# Altium schematic sheet PowerSupply.SchDoc
size A3; SheetNumber: 6; SheetTotal: 14
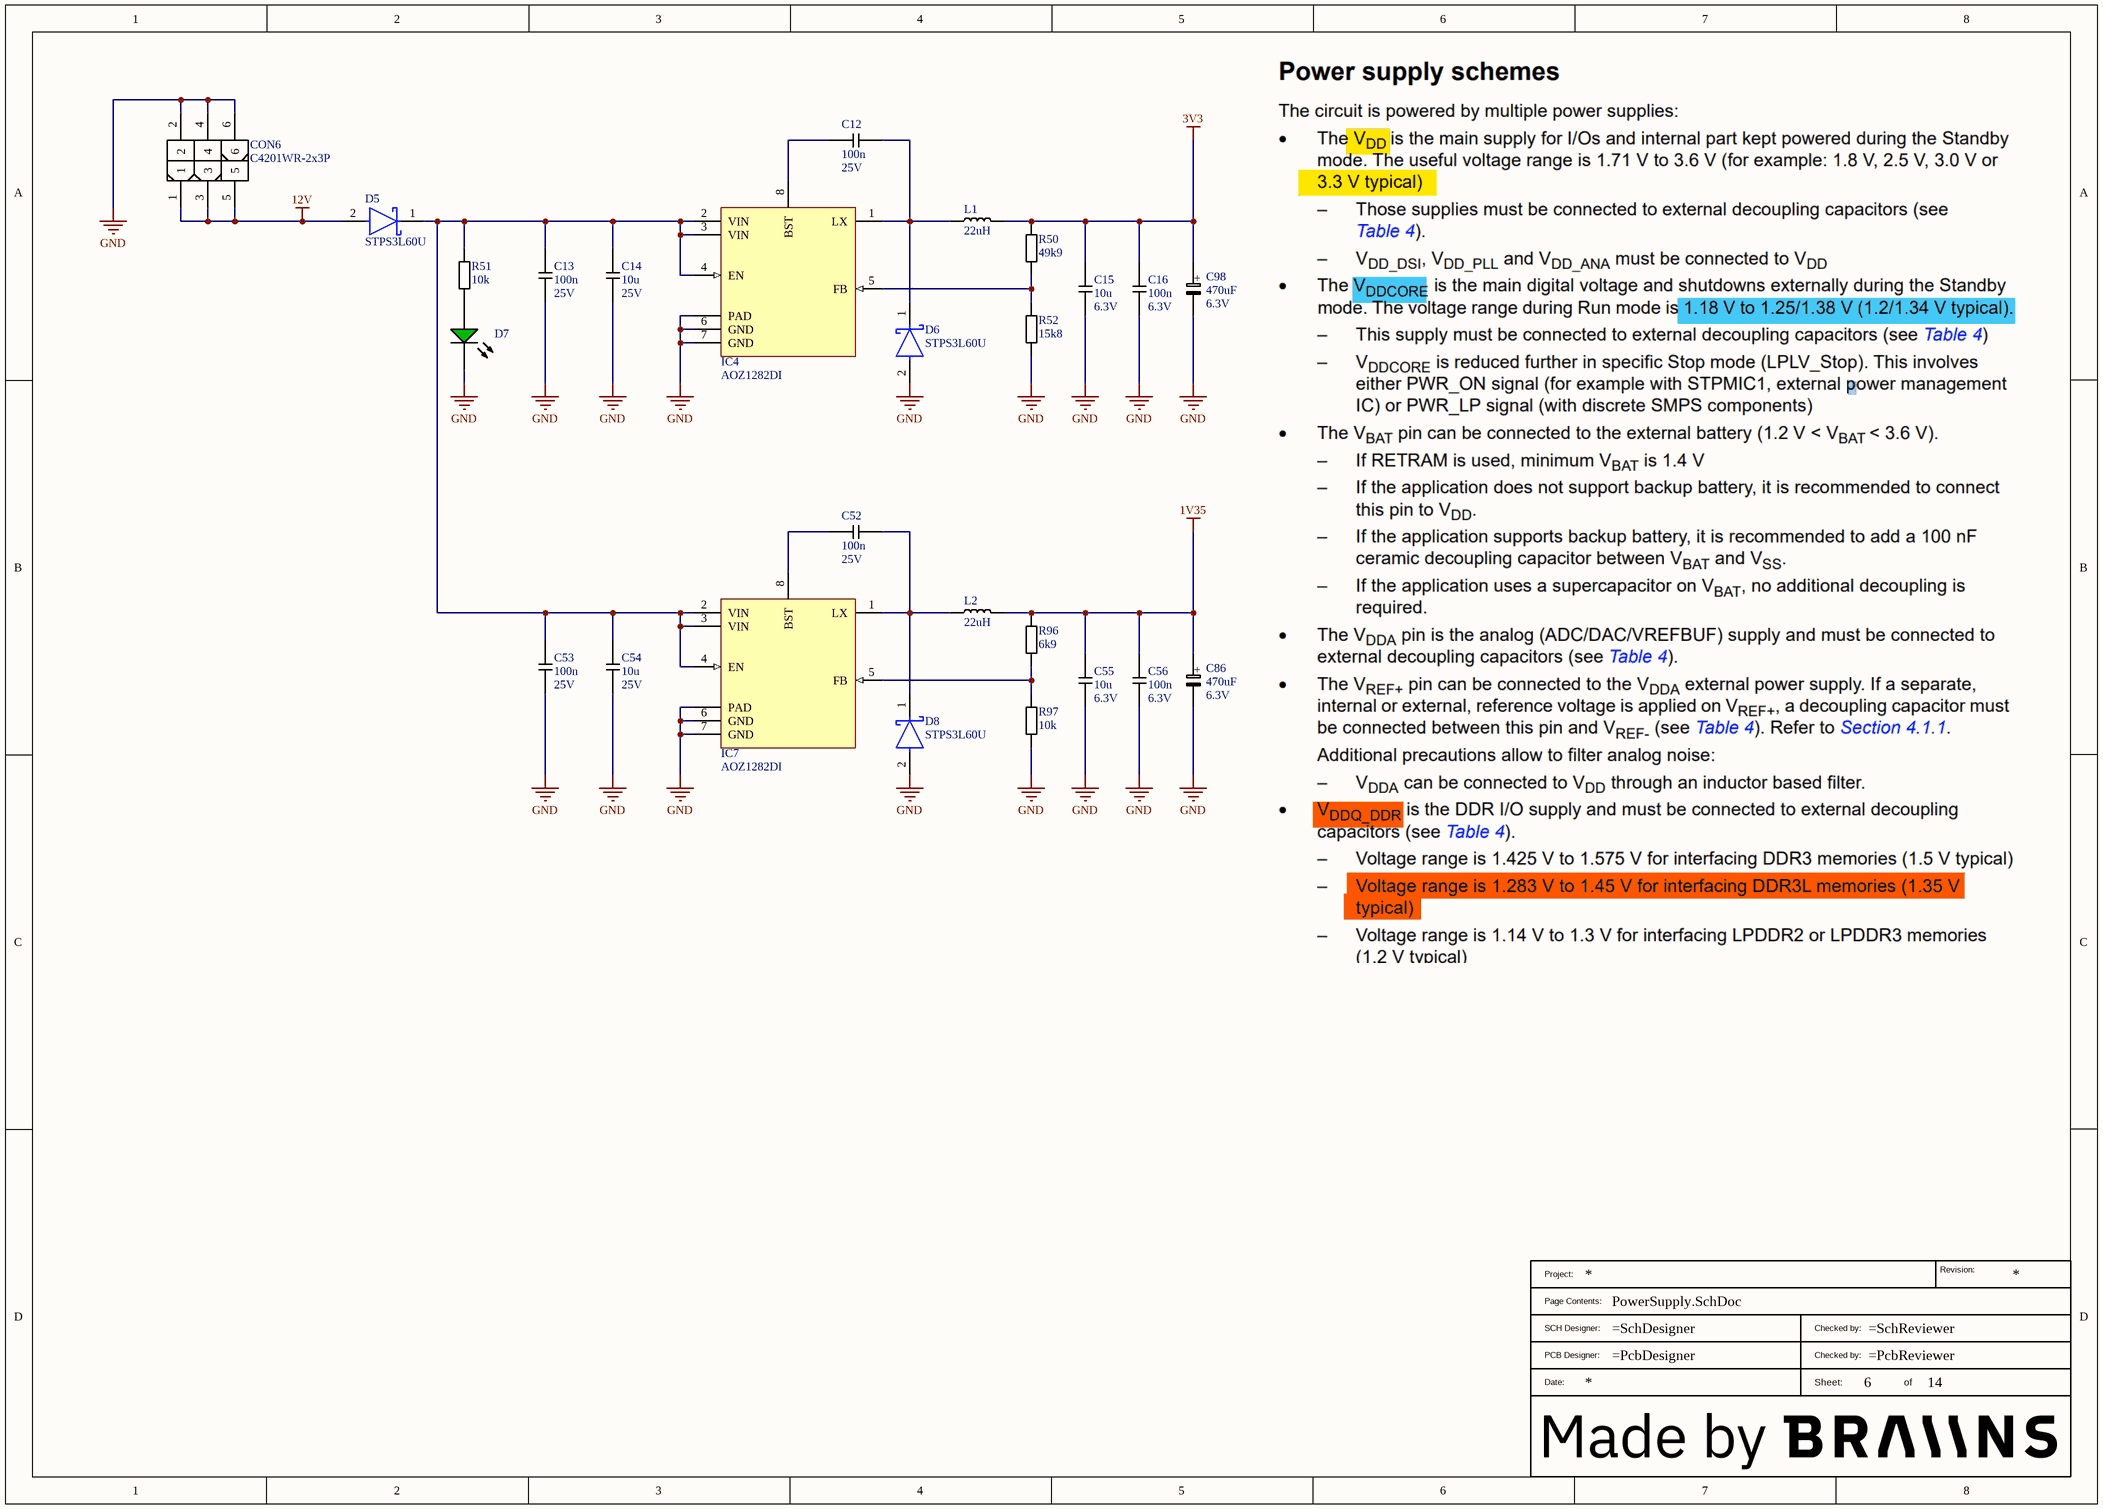
[diagram p0: PowerSupply.SchDoc]

## Parts
?  BraiinsTitleBlockWithLogo  (value not drawn)  (graphical)
C12  Voltage_Rating: 25V  [CAP0603]  (hidden comment: 100n)
C13  Voltage_Rating: 25V  [CAP0603]  (hidden comment: 100n)
C14  Voltage_Rating: 25V  [CAP1206]  (hidden comment: 10u)
C15  Voltage_Rating: 6.3V  [CAP0805]  (hidden comment: 10u)
C16  Voltage_Rating: 6.3V  [CAP0402]  (hidden comment: 100n)
C52  Voltage_Rating: 25V  [CAP0603]  (hidden comment: 100n)
C53  Voltage_Rating: 25V  [CAP0603]  (hidden comment: 100n)
C54  Voltage_Rating: 25V  [CAP1206]  (hidden comment: 10u)
C55  Voltage_Rating: 6.3V  [CAP0805]  (hidden comment: 10u)
C56  Voltage_Rating: 6.3V  [CAP0402]  (hidden comment: 100n)
C86  Voltage_Rating: 6.3V  [CAP_EEEFTJ471XAP]  (hidden comment: 470uF)
C98  Voltage_Rating: 6.3V  [CAP_EEEFTJ471XAP]  (hidden comment: 470uF)
CON6  C4201WR-2x3P  [MOLEX_39301061]
D5  STPS3L60U  [FP-SMB-MFG]
D6  STPS3L60U  [FP-SMB-MFG]
D7  FYLS-0603UGC  [AVAG-HSMX-C190_V]  (value not drawn)
D8  STPS3L60U  [FP-SMB-MFG]
IC4  AOZ1282DI  [DFN8_2X2]
IC7  AOZ1282DI  [DFN8_2X2]
L1  22uH  [VLS5045EX]
L2  22uH  [VLS5045EX]
R50  49k9  [RES0402]
R51  10k  [RES0603]
R52  15k8  [RES0402]
R96  6k9  [RES0402]
R97  10k  [RES0402]

## Nets
1V35: C55.1 C56.1 C86.1 L2.2 R96.1
3V3: C15.1 C16.1 C98.1 L1.2 R50.1
12V: CON6.1 CON6.3 CON6.5 D5.2(A)
GND: C13.2 C14.2 C15.2 C16.2 C53.2 C54.2 C55.2 C56.2 C86.2 C98.2 CON6.2 CON6.4 CON6.6 D6.2(A) D7.2(K) D8.2(A) IC4.6(GND) IC4.7(GND) IC4.PAD IC7.6(GND) IC7.7(GND) IC7.PAD R52.2 R97.2
NetC12_1: C12.1 IC4.8(BST)
NetC12_2: C12.2 D6.1(K) IC4.1(LX) L1.1
NetC13_1: C13.1 C14.1 C53.1 C54.1 D5.1(K) IC4.2(VIN) IC4.3(VIN) IC4.4(EN) IC7.2(VIN) IC7.3(VIN) IC7.4(EN) R51.1
NetC52_1: C52.1 IC7.8(BST)
NetC52_2: C52.2 D8.1(K) IC7.1(LX) L2.1
NetD7_1: D7.1(A) R51.2
NetIC4_5: IC4.5(FB) R50.2 R52.1
NetIC7_5: IC7.5(FB) R96.2 R97.1

## Notes on the sheet
- (in symbol 30239) +
- (in symbol BraiinsTitleBlockWithLogo) Revision:; Project:; Page Contents:; SCH Designer:; Checked by:; PCB Designer:; Date:; Sheet:; of

## Library data of the parts
C12 C13 C52 C53 = 30172: CAP CER 100n 10% 25V X7R 0603; Part_Type: Capacitor; Part_Status: New; ID: 30172; Updated By: janjuranek; Sorted_Value: 100; Value: 100n; Sub_Type: CER; Manufacturer Part Description: CAP CER 100n 10% 25V X7R 0603; Package_Case: 0603; RoHS: Yes; Dielectric: X7R; Tolerance: 10%; Created By: janjuranek; Created_Date: 2023-05-02 16:34:01; Updated_Date: 2023-05-02 16:34:23; ComponentLink1Description: Datasheet; ComponentLink2Description: Supplier Part Details
C14 C54 = 30171: CAP CER 10u 10% 25V X7R 1206; Part_Type: Capacitor; Part_Status: New; ID: 30171; Updated By: janjuranek; Sorted_Value: 10; Value: 10u; Sub_Type: CER; Manufacturer Part Description: CAP CER 10u 10% 25V X7R 1206; Package_Case: 1206; Dielectric: X7R; Tolerance: 10%; Created By: janjuranek; Created_Date: 2023-05-02 15:32:51; Updated_Date: 2023-05-02 15:37:12; ComponentLink1Description: Datasheet; ComponentLink2Description: Supplier Part Details
C15 C55 = 30174: CAP CER 10u 10% 6.3V X7R 0805; Part_Type: Capacitor; Part_Status: New; ID: 30174; Updated By: janjuranek; Sorted_Value: 10; Value: 10u; Sub_Type: CER; Manufacturer Part Description: CAP CER 10u 10% 6.3V X7R 0805; Package_Case: 0805; Dielectric: X7R; Tolerance: 10%; Created By: janjuranek; Created_Date: 2023-05-09 02:18:46; Updated_Date: 2023-05-09 02:19:22; ComponentLink1Description: Datasheet; ComponentLink2Description: Supplier Part Details; RoHS: Yes
C16 C56 = 30154: CAP CER 100n 10% 6.3V 0402; Part_Type: Capacitor; Part_Status: New; ID: 30154; Dielectric: X7R; Updated By: janjuranek; Sorted_Value: 100; Value: 100n; Sub_Type: CER; Manufacturer Part Description: CAP CER 100n 10% 6.3V 0402; Package_Case: 0402; RoHS: Yes; Tolerance: 10%; Created By: janjuranek; Created_Date: 2023-05-01 19:17:49; Updated_Date: 2023-05-01 19:19:14; ComponentLink1Description: Datasheet; ComponentLink2Description: Supplier Part Details
C86 C98 = 30239: CAP ELECT 470uF ±20% 6.3V Radial, Can - SMD; Part_Type: Capacitor; Manufacturer Part Number: EEE-FTJ471XAP; Manufacturer: Panasonic Electronic Components; Part_Status: New; ID: 30239; Sub_Type: POL; Updated By: janjuranek; Sorted_Value: 0,00047; Value: 470uF; Manufacturer Part Description: CAP ELECT 470uF ±20% 6.3V Radial, Can - SMD; Supplier 1: Digi-Key; Supplier Part Number 1: P15096TR-ND; Package_Case: Radial, Can - SMD; RoHS: Yes; Temperature Range: -55C to +105C; Tolerance: ±20%; Created By: janjuranek; Created_Date: 2023-10-13 11:39:12; Updated_Date: 2023-10-13 11:39:46; ComponentLink1Description: Datasheet; ComponentLink2Description: Supplier Part Details; ComponentLink2URL: https://www.digikey.com/products/en?keywords=EEE-FTJ471XAP
CON6 = 30196: CB Power Supply Connector; Manufacturer: CJT; Part_Status: New; ID: 30196; Updated By: janjuranek; Value: C4201WR-2x3P; Part_Type: Connector; Manufacturer Part Number: C4201WR-2x3P; Manufacturer Part Description: CB Power Supply Connector; Package_Case: THT; RoHS: Yes; Created By: janjuranek; Created_Date: 2023-06-06 15:12:03; Updated_Date: 2023-06-06 15:13:00; ComponentLink1Description: Datasheet; ComponentLink2Description: Supplier Part Details
D5 D6 D8 = CMP-12187-000023-1: DIODE SCHOTTKY 60V 3A SMB; Manufacturer: STMicroelectronics; Standoff Height: 0.05mm; Peak Reverse Current: 150uA; Max Junction Temp: +150°C; Max Surge Forward Current: 100A; Octopart: https://octopart.com/stps3l60u-stmicroelectronics-334329; Category: Diode; Height: 2.65mm; RoHS: TRUE; Mouser Description: Schottky diode Configuration: Single Housing type: DO-214AA=SMB Peak conducting-state current: 100 A; Forward Current: 3A; Manufacturer Part Number: STPS3L60U; Temperature: to +150°C; ComponentLink2URL: https://www.st.com/resource/en/datasheet/stps3l60.pdf; Max Repetitive Reverse Voltage: 60V; Device Class L1: Discrete Semiconductors; Automotive: No; Device Class L3: Schottky Diodes; Digikey Description: DIODE SCHOTTKY 60V 3A SMB; Lead Free: Yes; Temperature Range High: +150°C; Package: SMB; ComponentLink2Description: Datasheet; Device Class L2: Diodes
D7 = CMP-007-00013-2: LED Uni-Color Green, 52 mW, 20 mA, -40 to 85 degC, 2-Pin SMD, RoHS, Tape and Reel; Manufacturer: Avago; Forward Current: 20mA; Viewing Angle: 170degrees; Luminous Intensity: 15mcd; Lens Style: Diffused; Forward Voltage: 2.2V; Power: 52mW; Mounting Technology: SM; RoHS Compliant: True; Packaging: TapeandReel; Illumination Colour: Green; Datasheet URL: http://docs.avagotech.com/docs/AV02-0551EN; Min Operating Temperature: -40°C; Max Operating Temperature: 85°C; Pins: 2; Package Description: 2-Pin Surface Mount Device, Body 1.6 x 0.8 mm, Height 0.9 mm; Nominal Vf: 2.2V; Case/Package: 0603; Manufacturer URL: http://www.avagotech.com/; Datasheet Version: Mar-12; Colour: Green; Package Reference: HSMX-C190; Package Quantity: 4000
IC4 IC7 = 30108: 1.2A buck regulator, 4.5V to 36V, 450kHz; Part_Type: IC; Manufacturer: Alpha & Omeha; Part_Status: New; ID: 30108; Updated By: janjuranek; Value: AOZ1282DI; Manufacturer Part Number: AOZ1282DI; Manufacturer Part Description: 1.2A buck regulator, 4.5V to 36V, 450kHz; Package_Case: DFN8_2x2; RoHS: Yes; Created By: janjuranek; Created_Date: 2023-03-15 10:24:18; Updated_Date: 2023-03-15 10:26:02; ComponentLink1Description: Datasheet; ComponentLink2Description: Supplier Part Details
L1 L2 = 30147: INDUCTOR 22uH ±20% 1.8A; Manufacturer Part Number: VLS5045EX-220M-H; Manufacturer: TDK Corporation; Part_Status: New; ID: 30147; Updated By: janjuranek; Sorted_Value: 2,2E-5; Value: 22uH; Part_Type: Inductor; Manufacturer Part Description: INDUCTOR 22uH ±20% 1.8A; Supplier 1: Digi-Key; Supplier Part Number 1: 445-181623-2-ND; RoHS: Yes; Temperature Range: -40C to +125C; Tolerance: ±20%; Current_Rating: 1.8A; Created By: janjuranek; Created_Date: 2023-04-25 13:27:45; Updated_Date: 2023-04-25 13:28:20; ComponentLink1Description: Datasheet; ComponentLink2Description: Supplier Part Details; ComponentLink2URL: https://www.digikey.com/products/en?keywords=VLS5045EX-220M-H
R50 = 30164: RES 49k9 Ohm 1% 0402; Part_Status: New; ID: 30164; Updated By: janjuranek; Sorted_Value: 49; Value: 49k9; Part_Type: Resistor; Manufacturer Part Description: RES 49k9 Ohm 1% 0402; Package_Case: 0402; RoHS: Yes; Tolerance: 1%; Created By: janjuranek; Created_Date: 2023-05-01 19:45:19; Updated_Date: 2023-05-01 19:45:33; ComponentLink1Description: Datasheet; ComponentLink2Description: Supplier Part Details
R51 = 30092: RES 10k Ohm 1% 0603; Part_Status: New; ID: 30092; Updated By: janjuranek; Sorted_Value: 10000; Value: 10k; Part_Type: Resistor; Manufacturer Part Description: RES 10k Ohm 1% 0603; Package_Case: 0603; RoHS: Yes; Tolerance: 1%; Created By: janjuranek; Created_Date: 2023-03-07 16:44:40; Updated_Date: 2023-03-07 16:45:08; ComponentLink1Description: Datasheet; ComponentLink2Description: Supplier Part Details
R52 = 30165: RES 15k8 Ohm 1% 0402; Part_Status: New; ID: 30165; Updated By: janjuranek; Sorted_Value: 15; Value: 15k8; Part_Type: Resistor; Manufacturer Part Description: RES 15k8 Ohm 1% 0402; Package_Case: 0402; RoHS: Yes; Tolerance: 1%; Created By: janjuranek; Created_Date: 2023-05-01 19:45:37; Updated_Date: 2023-05-01 19:45:52; ComponentLink1Description: Datasheet; ComponentLink2Description: Supplier Part Details
R96 = 30153: RES 6k9 Ohm 1% 0402; Part_Status: New; ID: 30153; Updated By: janjuranek; Sorted_Value: 6; Value: 6k9; Part_Type: Resistor; Manufacturer Part Description: RES 6k9 Ohm 1% 0402; Package_Case: 0402; RoHS: Yes; Tolerance: 1%; Created By: janjuranek; Created_Date: 2023-05-01 18:44:43; Updated_Date: 2023-05-01 18:45:19; ComponentLink1Description: Datasheet; ComponentLink2Description: Supplier Part Details
R97 = 30071: RES 10k Ohm 1% 0402; Part_Status: New; ID: 30071; Updated By: Jan; Sorted_Value: 10000; Value: 10k; Part_Type: Resistor; Manufacturer Part Description: RES 10k Ohm 1% 0402; Package_Case: 0402; RoHS: Yes; Tolerance: 1%; Created By: Jan; Created_Date: 2023-03-02 13:13:56; Updated_Date: 2023-03-02 13:14:31; ComponentLink1Description: Datasheet; ComponentLink2Description: Supplier Part Details; Temperature Range: -40 to +150C